# EAGLE design ChargeModule (EAGLE 9.0.1)
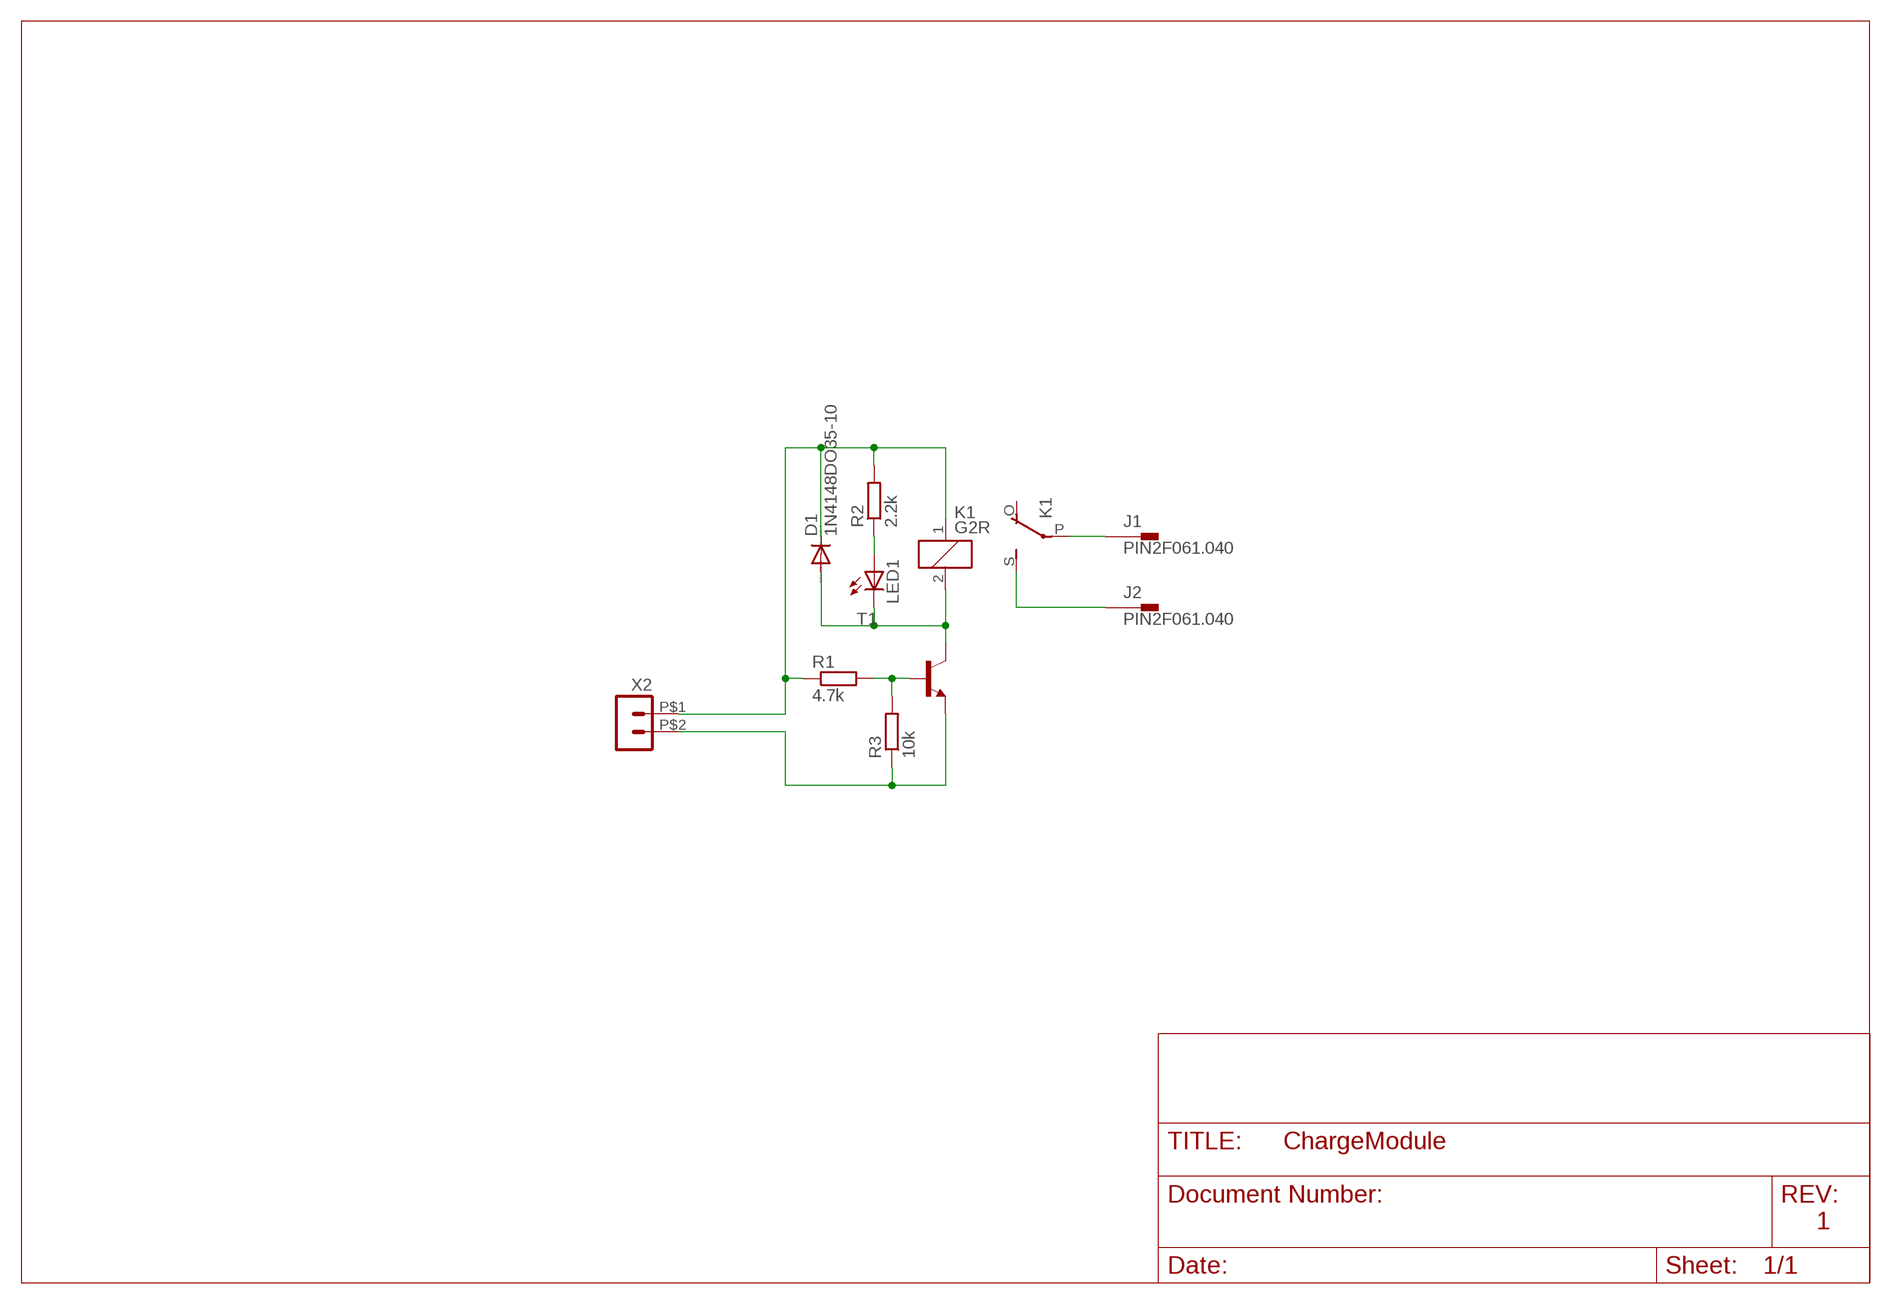
[diagram p0: schematic, sheet 1]

## Parts
D1  1N4148DO35-10  [DO35-10]
J1  PIN2F061.040  [F061.040]
J2  PIN2F061.040  [F061.040]
K1  G2R  [G2R]
LED1  LED3MM  [LED3MM]
R1  4.7k  R-EU_0207/10  [0207/10]
R2  2.2k  R-EU_0207/10  [0207/10]
R3  10k  R-EU_0207/10  [0207/10]
T1  BC337-16-NPN-TO92-CBE  [TO92-CBE]
X2  HEADER_POS2_43650-0200  [43650-0200]

## Nets
N$1: R1.2 R3.2 T1.B
N$2: D1.A K1.2 LED1.K(C) T1.C
N$6: J1.A1 J1.A2 K1.P(2:P)
N$7: R3.1 T1.E X2.P$2
N$8: LED1.A R2.1
N$10: D1.C K1.1 R1.1 R2.2 X2.P$1
N$11: J2.A1 J2.A2 K1.S(2:S)
Unconnected: K1.O(2:O)

## Notes on the sheet
- 1

## Library data of the parts
D1 = diode:1N4148: DIODE high speed (Philips)
J1 J2 = con-faston:PIN2: Flachstecker Typ Tyco/Electronics/AMP TAB, FASTON Printed Circuit Board Tabs Source: http://www.buerklin.com, http://catalog.tycoelectronics.com; OC_FARNELL: unknown; OC_NEWARK: unknown
K1 = relay:G2R: RELAY 1 x switch, Omron; OC_FARNELL: 1569185; OC_NEWARK: unknown
LED1 = led:LED: LED OSRAM: - CHIPLED LG R971, LG N971, LY N971, LG Q971, LY Q971, LO R971, LY R971 LH N974, LH R974 LS Q976, LO Q976, LY Q976 LO Q996 - Hyper CHIPLED LW Q18S LB Q993, LB Q99A, LB R99A - SideLED LS A670, LO A670, LY A670, LG A670, LP A670 LB A673, LV A673, LT A673, LW A673 LH A674 LY A675 LS A676, LA A676, LO A676, LY A676, LW A676 LS A679, LY A679, LG A679 - Hyper Micro SIDELED® LS Y876, LA Y876, LO Y876, LY Y876 LT Y87S - SmartLED LW L88C, LW L88S LB L89C, LB L89S, LG L890 LS L89K, LO L89K, LY L89K LS L896, LA L896, LO L896, LY L896 - TOPLED LS T670, LO T670, LY T670, LG T670, LP T670 LSG T670, LSP T670, LSY T670, LOP T670, LYG T670 LG T671, LOG T671, LSG T671 LB T673, LV T673, LT T673, LW T673 LH T674 LS T676, LA T676, LO T676, LY T676, LB T676, LH T676, LSB T676, LW T676 LB T67C, LV T67C, LT T67C, LS T67K, LO T67K, LY T67K, LW E67C LS E67B, LA E67B, LO E67B, LY E67B, LB E67C, LV E67C, LT E67C LW T67C LS T679, LY T679, LG T679 LS T770, LO T770, LY T770, LG T770, LP T770 LB T773, LV T773, LT T773, LW T773 LH T774 LS E675, LA E675, LY E675, LS T675 LS T776, LA T776, LO T776, LY T776, LB T776 LHGB T686 LT T68C, LB T68C - Hyper Mini TOPLED® LB M676 - Mini TOPLED Santana® LG M470 LS M47K, LO M47K, LY M47K Source: http://www.osram.convergy.de LUXEON: - LUMILED® LXK2-PW12-R00, LXK2-PW12-S00, LXK2-PW14-U00, LXK2-PW14-V00 LXK2-PM12-R00, LXK2-PM12-S00, LXK2-PM14-U00 LXK2-PE12-Q00, LXK2-PE12-R00, LXK2-PE12-S00, LXK2-PE14-T00, LXK2-PE14-U00 LXK2-PB12-K00, LXK2-PB12-L00, LXK2-PB12-M00, LXK2-PB14-N00, LXK2-PB14-P00, LXK2-PB14-Q00 LXK2-PR12-L00, LXK2-PR12-M00, LXK2-PR14-Q00, LXK2-PR14-R00 LXK2-PD12-Q00, LXK2-PD12-R00, LXK2-PD12-S00 LXK2-PH12-R00, LXK2-PH12-S00 LXK2-PL12-P00, LXK2-PL12-Q00, LXK2-PL12-R00 Source: www.luxeon.com KINGBRIGHT: KA-3528ASYC Source: www.kingbright.com
R1-R3 = resistor:R-EU_: RESISTOR, European symbol
T1 = transistor:*-NPN-: NPN Transistror BF959 corrected 2008.03.06
X2 = con-molex-micro-fit-3_0:HEADER_POS2_?: Molex - Micro-Fit 3.0 Series connector, 3.00mm (0.118") pitch header, 2 positions.

## Board
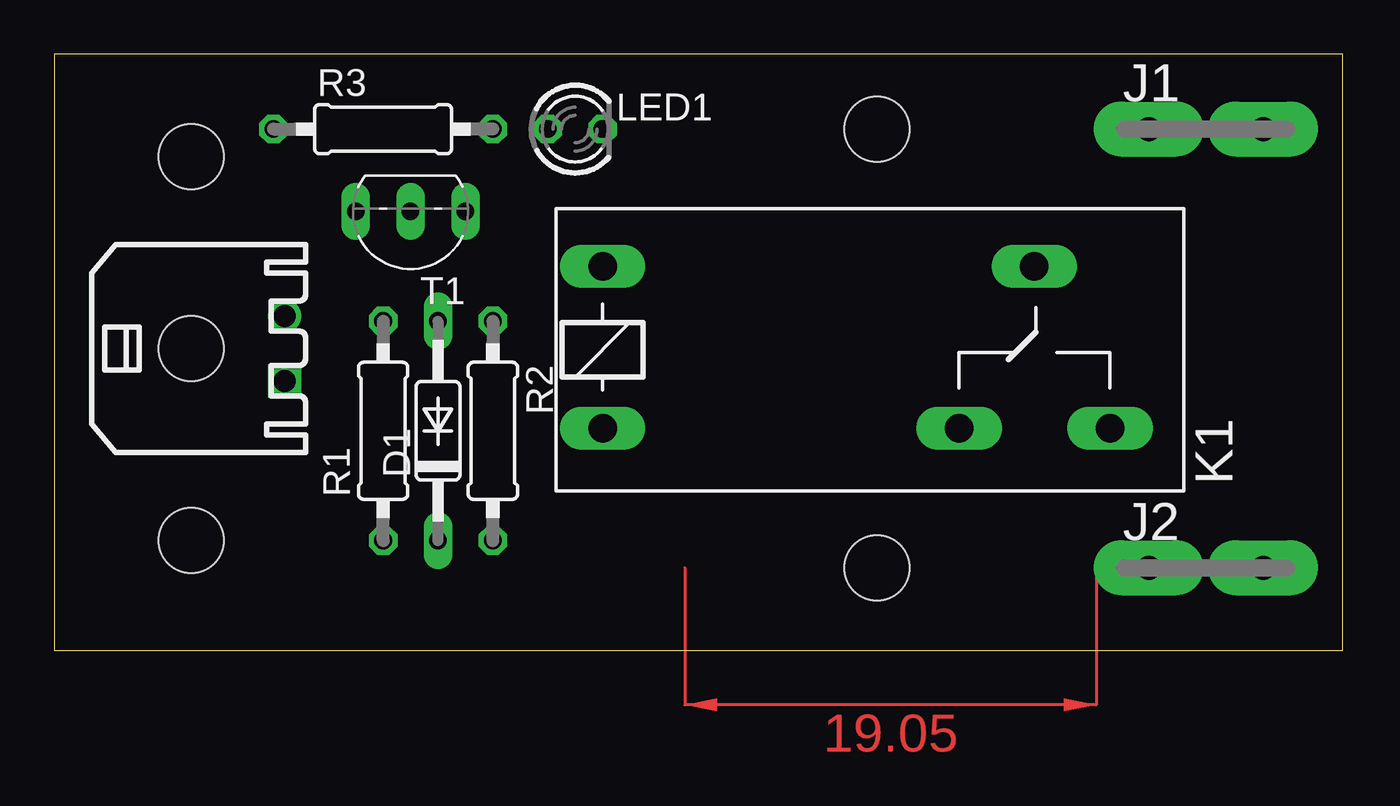
[diagram p1: board, top side]
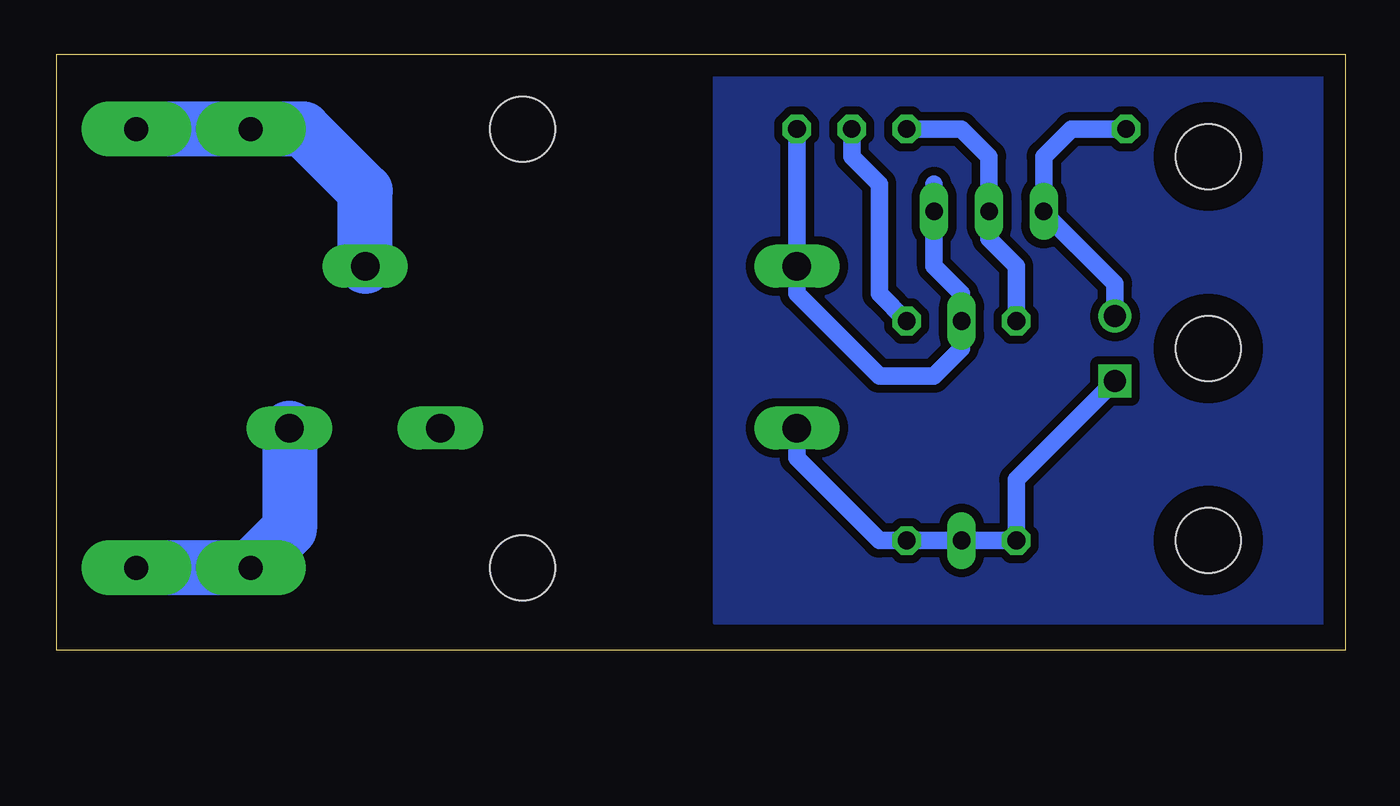
[diagram p2: board, bottom side, seen from below]

Size 59.67 x 27.61 mm. Coordinates in mm from the lower left corner, seen from the top.
Outline: 0,0 59.67,0 59.67,27.61 0,27.61 0,0
Copper layers (1*16): Top 0.035mm / dielectric 1.5mm / Bottom 0.035mm
Design rules "default": minimum track width 6mil, minimum drill 0.35mm, track to track 6mil, track to pad 6mil, pad to pad 6mil, via to via 6mil, smd to smd 6mil, copper to edge 40mil, drill to drill 6mil, minimum pad ring 10mil, minimum via ring 8mil, stop-mask expansion 4mil, vias tented up to drill 0mil, thermal gap 10mil
Holes 3 mm at 38.1,24.13 38.1,3.81 6.35,22.86 6.35,5.08

### Footprints (pad centres in the part's own frame; a part is rotated, then mirrored left to right if it is on the bottom)
DO35-10 = drill 0.813 long: A 5.08,0; C -5.08,0
F061.040 = drill 1.1 pad 2.54 long: A1 -2.65,0; A2 2.65,0
G2R = drill 1.321 long: 1 -2.54,-3.683; 2 -2.54,3.81; O 13.97,-3.683; P 17.45,3.81; S 20.955,-3.683
LED3MM = drill 0.813 octagon: A -1.27,0; K 1.27,0
0207/10 = drill 0.813 octagon: 1 -5.08,0; 2 5.08,0
TO92-CBE = drill 0.813 long: B 0,0; C -2.54,0; E 2.54,0
43650-0200 = drill 1.02 square: P$1 1.5,4.32 | drill 1.02: P$2 -1.5,4.32 | hole 3: 0,0

### Placement (x,y rotation side)
D1  17.78,10.16 90 top
J1  53.34,24.13 0 top
J2  53.34,3.81 0 top
K1  27.94,13.97 0 top
LED1  24.13,24.13 0 top
R1  15.24,10.16 90 top
R2  20.32,10.16 270 top
R3  15.24,24.13 0 top
T1  16.51,20.32 180 top
X2  6.35,13.97 270 top

### Tracks (layer width: path | path; a pad name or v marks a point on that pad's centre or on a via)
N$1
  Bottom 0.813: R1.2 15.24,17.78 16.51,19.05 T1.B 16.51,22.86 17.78,24.13 R3.2
N$2
  Bottom 0.813: 19.05,21.59 T1.C 19.05,17.78 17.78,16.51 D1.A 17.78,13.97 19.05,12.7 21.59,12.7 25.4,16.51 K1.2 LED1.K
N$6
  Bottom 2.54: K1.P 45.39,21.26 48.26,24.13 J1.A1 J1.A2
N$7
  Bottom 0.813: R3.1 12.7,24.13 13.97,22.86 T1.E 13.97,20.27 10.67,16.97 X2.P$2
N$8
  Bottom 0.813: R2.1 21.59,16.51 21.59,21.59 22.86,22.86 LED1.A
N$9
  pour Bottom (isolate 0.381): 0,27.94 29.21,27.94 29.21,1.27 0,1.27
N$10
  Bottom 0.813: X2.P$1 15.24,7.9 R1.1 D1.C R2.2 21.59,5.08 25.4,8.89 K1.1
N$11
  Bottom 2.54: K1.S 48.9,5.61 J2.A1 J2.A2
(copper drawn outside any net)
  shapes: Top area x1